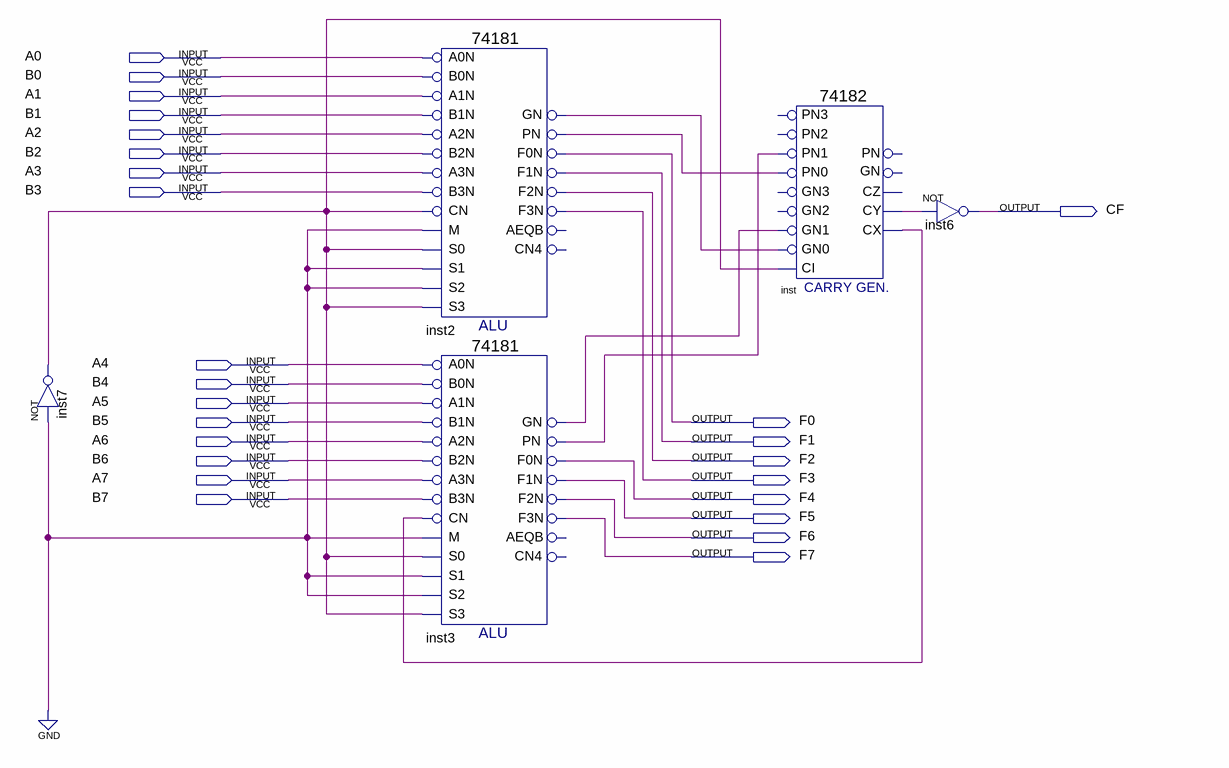
[diagram p0: schematic sheet]
// Quartus schematic ADD8.bdf as structural Verilog: 5 symbols, 25 pins
module ADD8 (
  input  A0,
  input  B0,
  input  A1,
  input  B1,
  input  A2,
  input  B2,
  input  A3,
  input  B3,
  input  A4,
  input  B4,
  input  A5,
  input  B5,
  input  A6,
  input  B6,
  input  A7,
  input  B7,
  output CF,
  output F0,
  output F1,
  output F2,
  output F3,
  output F4,
  output F5,
  output F6,
  output F7
);

  wire inst2_gn, inst2_pn, inst3_gn, inst3_pn, inst7_out, inst_cx, inst_cy;

  not inst7 (inst7_out, 1'b0);
  \74181  inst2 (
    .B0N(B0), .A0N(A0), .A1N(A1), .B1N(B1), .A3N(A3), .B2N(B2), .A2N(A2), .M(1'b0), .CN(inst7_out), .B3N(B3),
    .S2(1'b0), .S1(1'b0), .S0(inst7_out), .S3(inst7_out), .PN(inst2_pn), .GN(inst2_gn), .F3N(F3), .F1N(F1),
    .F0N(F0), .F2N(F2));  // open: AEQB, CN4
  \74181  inst3 (
    .B0N(B4), .A0N(A4), .A1N(A5), .B1N(B5), .A3N(A7), .B2N(B6), .A2N(A6), .M(1'b0), .CN(inst_cx), .B3N(B7),
    .S2(1'b0), .S1(1'b0), .S0(inst7_out), .S3(inst7_out), .PN(inst3_pn), .GN(inst3_gn), .F3N(F7), .F1N(F5),
    .F0N(F4), .F2N(F6));  // open: AEQB, CN4
  \74182  inst (
    .CI(inst7_out), .PN1(inst3_pn), .PN0(inst2_pn), .GN1(inst3_gn), .GN0(inst2_gn), .CY(inst_cy), .CX(inst_cx));  // open: PN2, GN2, GN3, PN3, PN, CZ, GN
  not inst6 (CF, inst_cy);
endmodule
